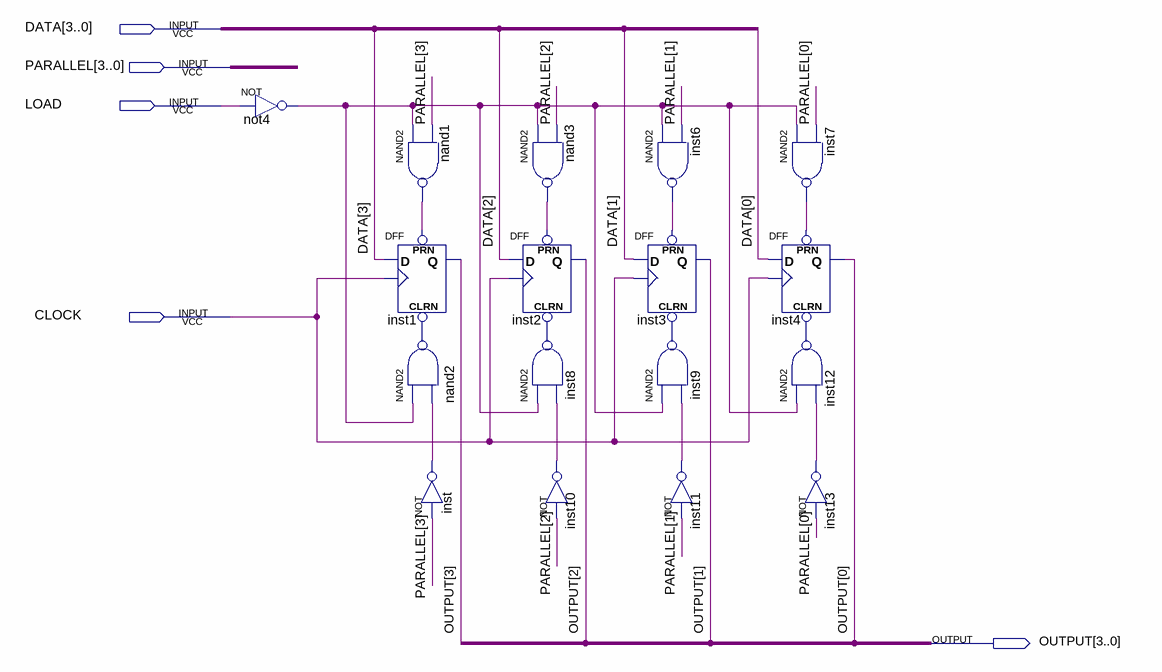
[diagram p0: schematic sheet]
// Quartus schematic REGISTER_4BIT.bdf as structural Verilog: 17 symbols, 5 pins
module REGISTER_4BIT (
  input  [3:0] DATA,
  input  [3:0] PARALLEL,
  input  LOAD,
  input  CLOCK,
  output [3:0] OUTPUT
);

  wire inst6_out, inst7_out, inst8_out, inst9_out, inst10_out, inst11_out, inst12_out, inst13_out, inst_out,
       nand1_out, nand2_out, nand3_out, not4_out;

  not not4 (not4_out, LOAD);
  nand nand1 (nand1_out, not4_out, PARALLEL[3]);
  DFF inst1 (.CLRN(nand2_out), .CLK(CLOCK), .D(DATA[3]), .PRN(nand1_out), .Q(OUTPUT[3]));
  nand nand2 (nand2_out, not4_out, inst_out);
  not inst (inst_out, PARALLEL[3]);
  nand nand3 (nand3_out, not4_out, PARALLEL[2]);
  DFF inst2 (.CLRN(inst8_out), .CLK(CLOCK), .D(DATA[2]), .PRN(nand3_out), .Q(OUTPUT[2]));
  nand inst8 (inst8_out, not4_out, inst10_out);
  not inst10 (inst10_out, PARALLEL[2]);
  nand inst6 (inst6_out, not4_out, PARALLEL[1]);
  DFF inst3 (.CLRN(inst9_out), .CLK(CLOCK), .D(DATA[1]), .PRN(inst6_out), .Q(OUTPUT[1]));
  nand inst9 (inst9_out, not4_out, inst11_out);
  not inst11 (inst11_out, PARALLEL[1]);
  nand inst7 (inst7_out, not4_out, PARALLEL[0]);
  DFF inst4 (.CLRN(inst12_out), .CLK(CLOCK), .D(DATA[0]), .PRN(inst7_out), .Q(OUTPUT[0]));
  nand inst12 (inst12_out, not4_out, inst13_out);
  not inst13 (inst13_out, PARALLEL[0]);
endmodule
